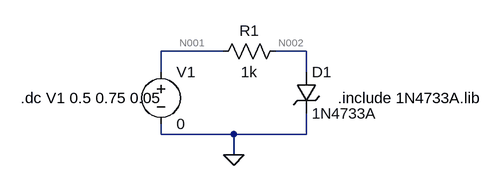
[diagram p0: schematic ZENER_FORWARD.asc]
ZENER_FORWARD.asc, the LTspice schematic file:
Version 4.1
SHEET 1 880 680
WIRE 208 96 112 96
WIRE 336 96 288 96
WIRE 112 128 112 96
WIRE 336 128 336 96
WIRE 112 224 112 208
WIRE 224 224 112 224
WIRE 336 224 336 192
WIRE 336 224 224 224
WIRE 224 256 224 224
FLAG 224 256 0
SYMBOL voltage 112 112 R0
SYMATTR InstName V1
SYMATTR Value 0
SYMBOL res 304 80 R90
WINDOW 0 0 56 VBottom 2
WINDOW 3 32 56 VTop 2
SYMATTR InstName R1
SYMATTR Value 1k
SYMBOL zener 320 128 R0
SYMATTR InstName D1
SYMATTR Value 1N4733A
TEXT 384 168 Left 2 !.include 1N4733A.lib
TEXT -104 168 Left 2 !.dc V1 0.5 0.75 0.05

The netlist it stands for:
* ZENER_FORWARD.asc
V1 N001 0 0
R1 N002 N001 1k
D1 N002 0 1N4733A
.model D D
.lib standard.dio
.include 1N4733A.lib
.dc V1 0.5 0.75 0.05
.backanno
.end

* Results of the author's LTspice run, read from the files saved beside the schematic
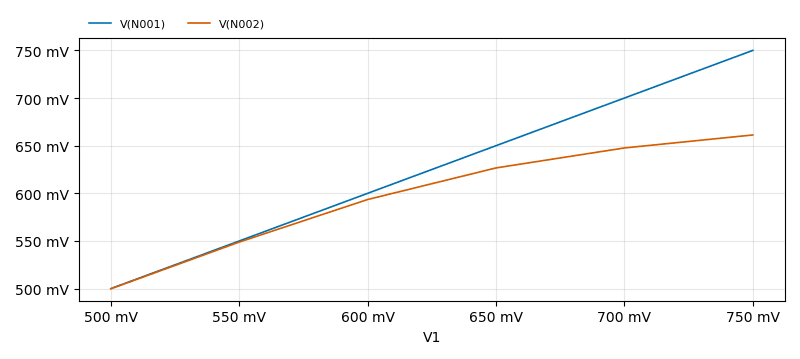
[diagram p1: DC transfer characteristic of ZENER_FORWARD.asc, plotted from the saved traces]
* DC transfer characteristic, 1 run:
*   V(N001): 500 mV at V1=500 mV, 750 mV at V1=750 mV, min 500 mV, max 750 mV
*   V(N002): 499.8 mV at V1=500 mV, 661.2 mV at V1=750 mV, min 499.8 mV, max 661.2 mV